# Altium schematic sheet REALY_AND_PRESSURE.SchDoc
size A4; SheetNumber: 5; SheetTotal: 7
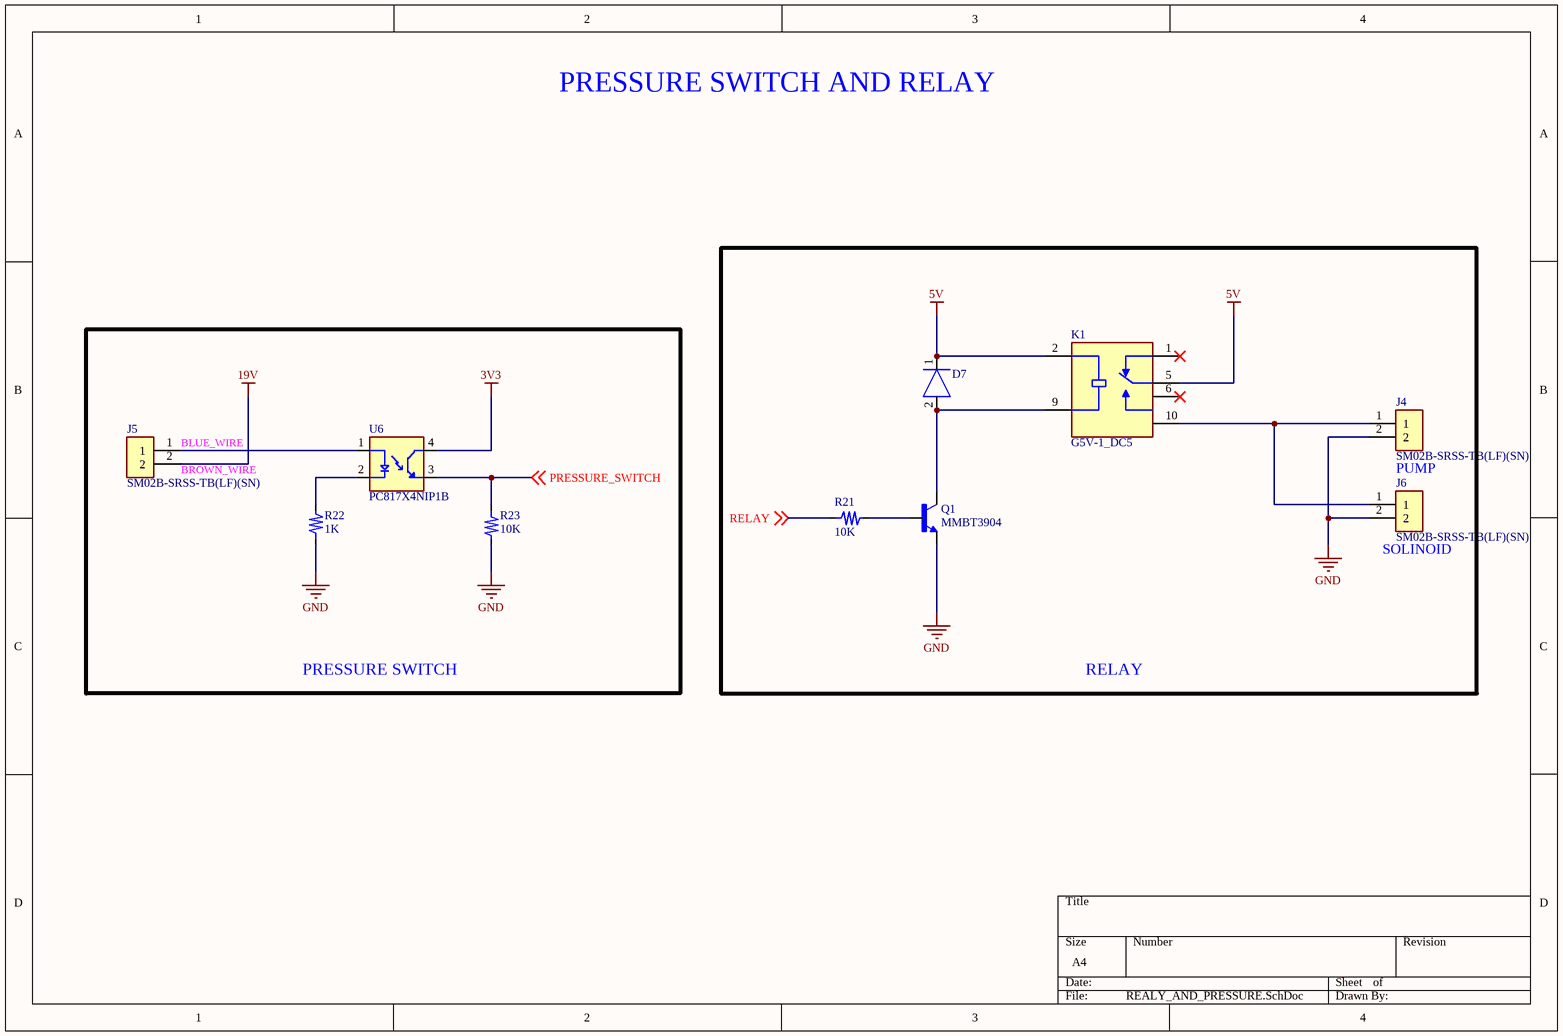
[diagram p0: REALY_AND_PRESSURE.SchDoc]

## Parts
D7  Diode  [RELAY DIODE]  (value not drawn)
J4  SM02B-SRSS-TB(LF)(SN)  [JST_BM02B-SRSS-TB(LF)(SN)]
J5  SM02B-SRSS-TB(LF)(SN)  [JST_BM02B-SRSS-TB(LF)(SN)]
J6  SM02B-SRSS-TB(LF)(SN)  [JST_BM02B-SRSS-TB(LF)(SN)]
K1  G5V-1_DC5  [RELAY_G5V-1_DC5]
Q1  MMBT3904  [TRANS_MMBT3904]
R21  10K  [RES 0603]
R22  1K  [RES 0603]
R23  10K  [RES 0603]
U6  PC817X4NIP1B  [SOIC254P960X420-4N]

## Blocks framed on the sheet
RELAY: D7 J4 J6 K1 Q1 R21
PRESSURE SWITCH: J5 R22 R23 U6

## Nets
3V3: U6.4(CT)
5V: D7.1 K1.2(COIL1) K1.5(COM)
19V: J5.2
GND: J4.2 J6.2 Q1.2(E) R22.1 R23.2
PRESSURE_SWITCH: R23.1 U6.3(ET) ; off-sheet PRESSURE_SWITCH
RELAY: R21.1 ; off-sheet RELAY
NetD7_2: D7.2 K1.9(COIL2) Q1.3(C)
NetJ4_1: J4.1 J6.1 K1.10(NO)
NetJ5_1: J5.1 U6.1(A)
NetQ1_1: Q1.1(B) R21.2
NetR22_2: R22.2 U6.2(C)

Not connected (* = marked no-connect by the designer): K1 1(NC)* 6(COM)*

## Notes on the sheet
- PRESSURE SWITCH AND RELAY
- (near J5) BLUE_WIRE
- (near J5) BROWN_WIRE
- PUMP
- (near J6) SOLINOID

## Library data of the parts
D7 = Diode: Manufacture: YONGYUTAI; Part Number: 1N4002; Footprint size: SMA; Supplier Part Number: C3038772; Supplier: LCSC; Link: https://www.lcsc.com/product-detail/C3038772.html?s_z=n_q_C3038772
J4-J6 = SM02B-SRSS-TB(LF)(SN): Connector Header Surface Mount, Right Angle 2 position 0.039 (1.00mm); Manufacture: JST; Part Number: BM02B-SRSS-TB(LF)(SN); Footprint size: SMD,P=1mm; Supplier: LCSC; Supplier Part Number: C160388; Link: https://www.lcsc.com/product-detail/C160388.html?s_z=n_q_BM02B-SRSS-TB%2520%28LF%29%28SN%29&spm=wm.ssy.bg.0.xh&lcsc_vid=RFYMBlMFQAQLUVJeFVJZXwVeRFYIAgBXEVkPUlxRRVUxVlNRQFVaV1JfRVBbXjsOAxUeFF5JWBYZEEoKFBINSQcJGk4%3D
K1 = G5V-1_DC5: General Purpose Relay SPDT (1 Form C) Through Hole; Manufacture: OMRON; Part Number: G5V-1 DC5; Footprint size: DIP,12.5x7.5mm; Supplier: LCSC; Supplier Part Number: C28695; Link: https://www.lcsc.com/product-detail/C28695.html?s_z=n_q_G5V-1%2520DC5&spm=wm.fly.bg.0.xh&lcsc_vid=RFYMBlMFQAQLUVJeFVJZXwVeRFYIAgBXEVkPUlxRRVUxVlNRT1BZUVdRTldWVDsOAxUeFF5JWBYZEEoKFBINSQcJGk4eFQsCAgIaSgADAwAHC0slRVFbVVJIHxUDCw%3D%3D
Q1 = MMBT3904: BJT, SOT-23, 40V, 200mA, NPN, 0.35W, 150Â°C; Manufacture: JSCJ; Part Number: MMBT3904(RANGE:100-300); Footprint size: SOT-23; Supplier: LCSC; Supplier Part Number: C20526; Link: https://www.lcsc.com/product-detail/C20526.html?s_z=n_q_C20526&globalKeyword=C20526
R21 R23 = Resistor: Manufacture: FH; Part Number: RS-03K103JT; Footprint size: 0603; ComponentLink1Description: New link; ComponentLink1URL: *; Supplier: LCSC; Supplier Part Number: C73809; Link: https://www.lcsc.com/product-detail/C73809.html?spm=wm.fly.bg.0.xh&lcsc_vid=RFYMBlMFQAQLUVJeFVJZXwVeRFYIAgBXEVkPUlxRRVUxVlNRQVlaVFJeTlRfVDsOAxUeFF5JWBYZEEoKFBINSQcJGk4NBhADEA4cHktXRlhXSQwSGg0%3D
R22 = Resistor: Manufacture: FH; Part Number: RS-03K102JT; Footprint size: 0603; ComponentLink1Description: New link; ComponentLink1URL: *; Supplier: LCSC; Supplier Part Number: C73797; Link: https://www.lcsc.com/product-detail/C73797.html?spm=wm.fly.bg.0.xh&lcsc_vid=RFYMBlMFQAQLUVJeFVJZXwVeRFYIAgBXEVkPUlxRRVUxVlNRQVlaVFFSQ1NWVjsOAxUeFF5JWBYZEEoKFBINSQcJGk4NBhADEA4cHktXRlhXSQwSGg0%3D
U6 = PC817X4NIP1B: Optocoupler DC-IN 1-CH Transistor DC-OUT 4-Pin DIP SMD T/R; Manufacture: SHARP; Part Number: PC817X3NIP1B; Footprint size: SMD-4P; Supplier: LCSC; Supplier Part Number: C169111; Link: https://www.lcsc.com/product-detail/C169111.html?s_z=n_q_PC817X4NIP1B&spm=wm.ssy.bg.0.xh&lcsc_vid=RFYMBlMFQAQLUVJeFVJZXwVeRFYIAgBXEVkPUlxRRVUxVlNRQVlaUVBVRVJZXzsOAxUeFF5JWBYZEEoKFBINSQcJGk4eFQsCAgIaSgADAwAHC0slRlBWVF1SWQkaCgg%3D